# EAGLE design sit_up V2 (EAGLE 7.3.0)
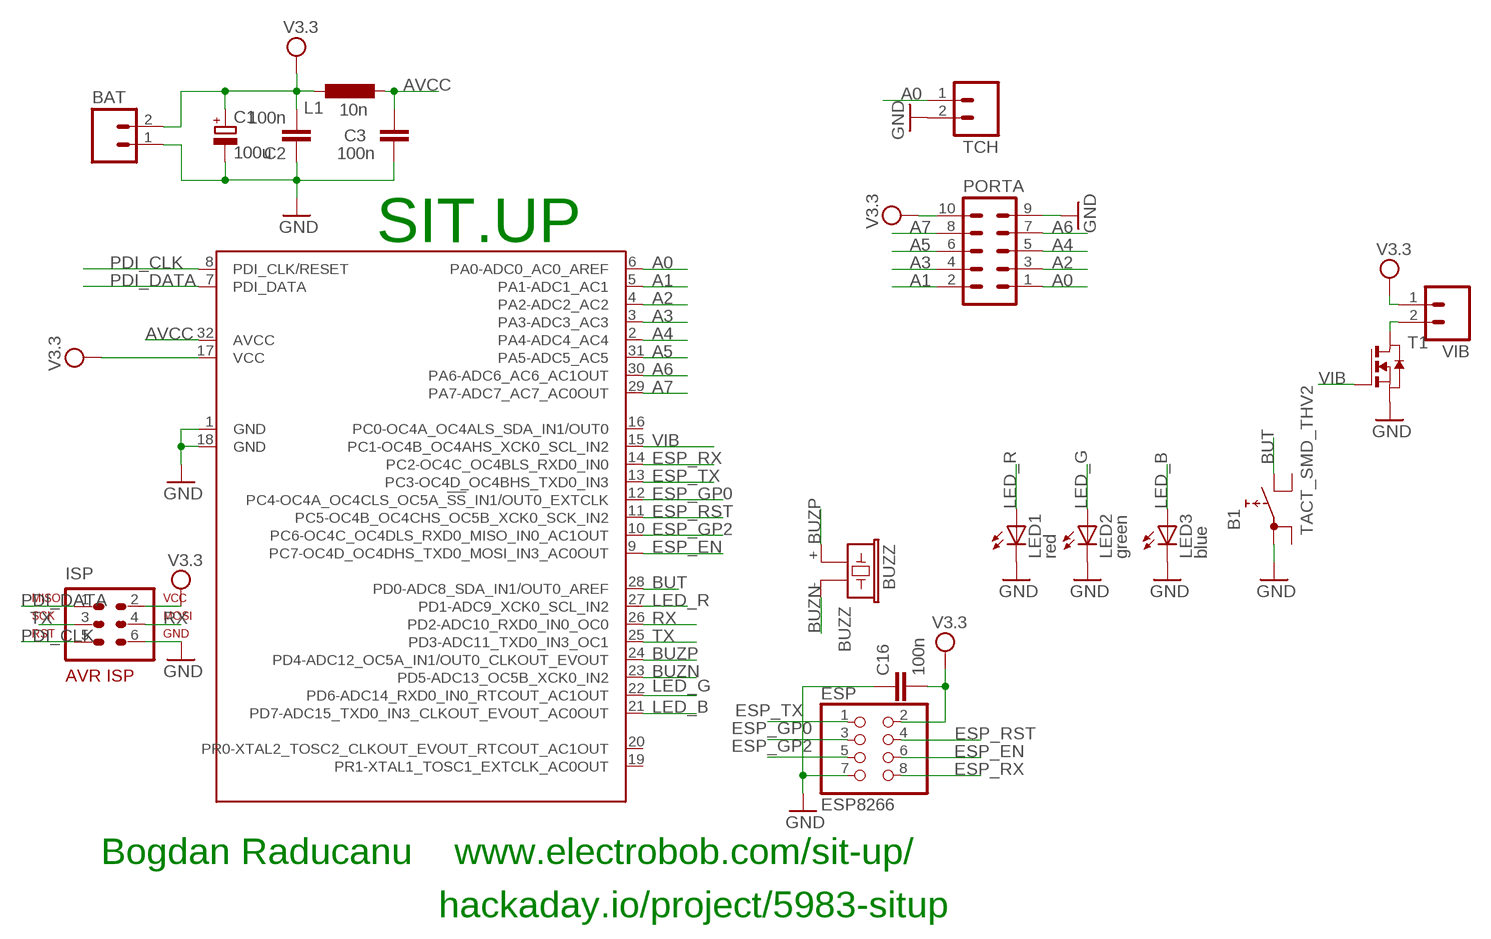
[diagram p0: schematic, sheet 1]

## Parts
B1  TACT_SMD_THV2  [TACT_6MM_SMD_2]
BAT  M02  [02P]
BUZZ  BUZZ  F/CM12P  [F/CM12P]
C1  100u  CPOL-EU153CLV-0505  [153CLV-0505]
C2  100n  C-EUC0805  [C0805]
C3  100n  C-EUC0805  [C0805]
C16  100n  C-EUC0805  [C0805]
ESP  ESP8266  PINHD-2X4  [2X04]
ISP  AVR-ISP-6VERT  [AVR-ISP-6]
L1  10n  L-EUL2012C  [L2012C]
LED1  red  LED3MM  [LED3MM]
LED2  green  LED3MM  [LED3MM]
LED3  blue  LED3MM  [LED3MM]
PORTA  MA05-2_PORT  [MA05_PORT]
T1  NMOSSOT23  [SOT-23]
TCH  M02  [02P]
VIB  M02  [02P]
XMEGA  XMEGA  E5-TQFP  [TQFP32]

## Nets
A0: PORTA.1 TCH.1 XMEGA.6(PA0-ADC0_AC0_AREF)
A1: PORTA.2 XMEGA.5(PA1-ADC1_AC1)
A2: PORTA.3 XMEGA.4(PA2-ADC2_AC2)
A3: PORTA.4 XMEGA.3(PA3-ADC3_AC3)
A4: PORTA.5 XMEGA.2(PA4-ADC4_AC4)
A5: PORTA.6 XMEGA.31(PA5-ADC5_AC5)
A6: PORTA.7 XMEGA.30(PA6-ADC6_AC6_AC1OUT)
A7: PORTA.8 XMEGA.29(PA7-ADC7_AC7_AC0OUT)
AVCC: C3.2 L1.2 XMEGA.32(AVCC)
BUT: B1.P$2(2A) XMEGA.28(PD0-ADC8_SDA_IN1/OUT0_AREF)
BUZN: BUZZ.- XMEGA.23(PD5-ADC13_OC5B_XCK0_IN2)
BUZP: BUZZ.+ XMEGA.24(PD4-ADC12_OC5A_IN1/OUT0_CLKOUT_EVOUT)
ESP_EN: ESP.6 XMEGA.9(PC7-OC4D_OC4DHS_TXD0_MOSI_IN3_AC0OUT)
ESP_GP0: ESP.3 XMEGA.12(PC4-OC4A_OC4CLS_OC5A_!SS!_IN1/OUT0_EXTCLK)
ESP_GP2: ESP.5 XMEGA.10(PC6-OC4C_OC4DLS_RXD0_MISO_IN0_AC1OUT)
ESP_RST: ESP.4 XMEGA.11(PC5-OC4B_OC4CHS_OC5B_XCK0_SCK_IN2)
ESP_RX: ESP.8 XMEGA.14(PC2-OC4C_OC4BLS_RXD0_IN0)
ESP_TX: ESP.1 XMEGA.13(PC3-OC4D_OC4BHS_TXD0_IN3)
GND: B1.P$1(1A) BAT.1 C1.- C2.1 C3.1 C16.1 ESP.7 ISP.6 LED1.K(C) LED2.K(C) LED3.K(C) PORTA.9 T1.2(S) TCH.2 XMEGA.1(GND) XMEGA.18(GND)
LED_B: LED3.A XMEGA.21(PD7-ADC15_TXD0_IN3_CLKOUT_EVOUT_AC0OUT)
LED_G: LED2.A XMEGA.22(PD6-ADC14_RXD0_IN0_RTCOUT_AC1OUT)
LED_R: LED1.A XMEGA.27(PD1-ADC9_XCK0_SCL_IN2)
N$4: T1.1(D) VIB.2
PDI_CLK: ISP.5 XMEGA.8(PDI_CLK/RESET)
PDI_DATA: ISP.1 XMEGA.7(PDI_DATA)
RX: ISP.4 XMEGA.26(PD2-ADC10_RXD0_IN0_OC0)
TX: ISP.3 XMEGA.25(PD3-ADC11_TXD0_IN3_OC1)
V3.3: BAT.2 C1.+ C2.2 C16.2 ESP.2 ISP.2 L1.1 PORTA.10 VIB.1 XMEGA.17(VCC)
VIB: T1.3(G) XMEGA.15(PC1-OC4B_OC4AHS_XCK0_SCL_IN2)
Unconnected: B1.P$3(1B) B1.P$4(2B) XMEGA.16(PC0-OC4A_OC4ALS_SDA_IN1/OUT0) XMEGA.19(PR1-XTAL1_TOSC1_EXTCLK_AC0OUT) XMEGA.20(PR0-XTAL2_TOSC2_CLKOUT_EVOUT_RTCOUT_AC1OUT)

## Notes on the sheet
- SIT.UP
- Bogdan Raducanu    www.electrobob.com/sit-up/
- hackaday.io/project/5983-situp

## Library data of the parts
B1 = tact:TACT_SMD_TH
BAT TCH VIB = con-amp-quick:M02: AMP QUICK CONNECTOR; OC_FARNELL: unknown; OC_NEWARK: unknown
BUZZ = buzzer:F/CM12P: BUZZER Source: Buerklin; OC_FARNELL: unknown; OC_NEWARK: unknown
C1 = rcl:CPOL-EU: POLARIZED CAPACITOR, European symbol
C2 C3 C16 = rcl:C-EU: CAPACITOR, European symbol
ESP = pinhead:PINHD-2X4: PIN HEADER
ISP = avr-7:AVR-ISP-6: AVR ISP-6 Serial Programming Header
L1 = resistor:L-EU: INDUCTOR, European symbol
LED1-LED3 = led:LED: LED OSRAM: - CHIPLED LG R971, LG N971, LY N971, LG Q971, LY Q971, LO R971, LY R971 LH N974, LH R974 LS Q976, LO Q976, LY Q976 LO Q996 - Hyper CHIPLED LW Q18S LB Q993, LB Q99A, LB R99A - SideLED LS A670, LO A670, LY A670, LG A670, LP A670 LB A673, LV A673, LT A673, LW A673 LH A674 LY A675 LS A676, LA A676, LO A676, LY A676, LW A676 LS A679, LY A679, LG A679 - Hyper Micro SIDELED® LS Y876, LA Y876, LO Y876, LY Y876 LT Y87S - SmartLED LW L88C, LW L88S LB L89C, LB L89S, LG L890 LS L89K, LO L89K, LY L89K LS L896, LA L896, LO L896, LY L896 - TOPLED LS T670, LO T670, LY T670, LG T670, LP T670 LSG T670, LSP T670, LSY T670, LOP T670, LYG T670 LG T671, LOG T671, LSG T671 LB T673, LV T673, LT T673, LW T673 LH T674 LS T676, LA T676, LO T676, LY T676, LB T676, LH T676, LSB T676, LW T676 LB T67C, LV T67C, LT T67C, LS T67K, LO T67K, LY T67K, LW E67C LS E67B, LA E67B, LO E67B, LY E67B, LB E67C, LV E67C, LT E67C LW T67C LS T679, LY T679, LG T679 LS T770, LO T770, LY T770, LG T770, LP T770 LB T773, LV T773, LT T773, LW T773 LH T774 LS E675, LA E675, LY E675, LS T675 LS T776, LA T776, LO T776, LY T776, LB T776 LHGB T686 LT T68C, LB T68C - Hyper Mini TOPLED® LB M676 - Mini TOPLED Santana® LG M470 LS M47K, LO M47K, LY M47K Source: http://www.osram.convergy.de LUXEON: - LUMILED® LXK2-PW12-R00, LXK2-PW12-S00, LXK2-PW14-U00, LXK2-PW14-V00 LXK2-PM12-R00, LXK2-PM12-S00, LXK2-PM14-U00 LXK2-PE12-Q00, LXK2-PE12-R00, LXK2-PE12-S00, LXK2-PE14-T00, LXK2-PE14-U00 LXK2-PB12-K00, LXK2-PB12-L00, LXK2-PB12-M00, LXK2-PB14-N00, LXK2-PB14-P00, LXK2-PB14-Q00 LXK2-PR12-L00, LXK2-PR12-M00, LXK2-PR14-Q00, LXK2-PR14-R00 LXK2-PD12-Q00, LXK2-PD12-R00, LXK2-PD12-S00 LXK2-PH12-R00, LXK2-PH12-S00 LXK2-PL12-P00, LXK2-PL12-Q00, LXK2-PL12-R00 Source: www.luxeon.com KINGBRIGHT: KA-3528ASYC Source: www.kingbright.com
PORTA = con-lstb:MA05-2: PIN HEADER
T1 = zetex:NMOSSOT23: MOS FET; OC_FARNELL: unknown; OC_NEWARK: unknown
XMEGA = Xmegae5:E5

## Net classes
1 power: width 0.381 mm, clearance 0.254 mm

## Board
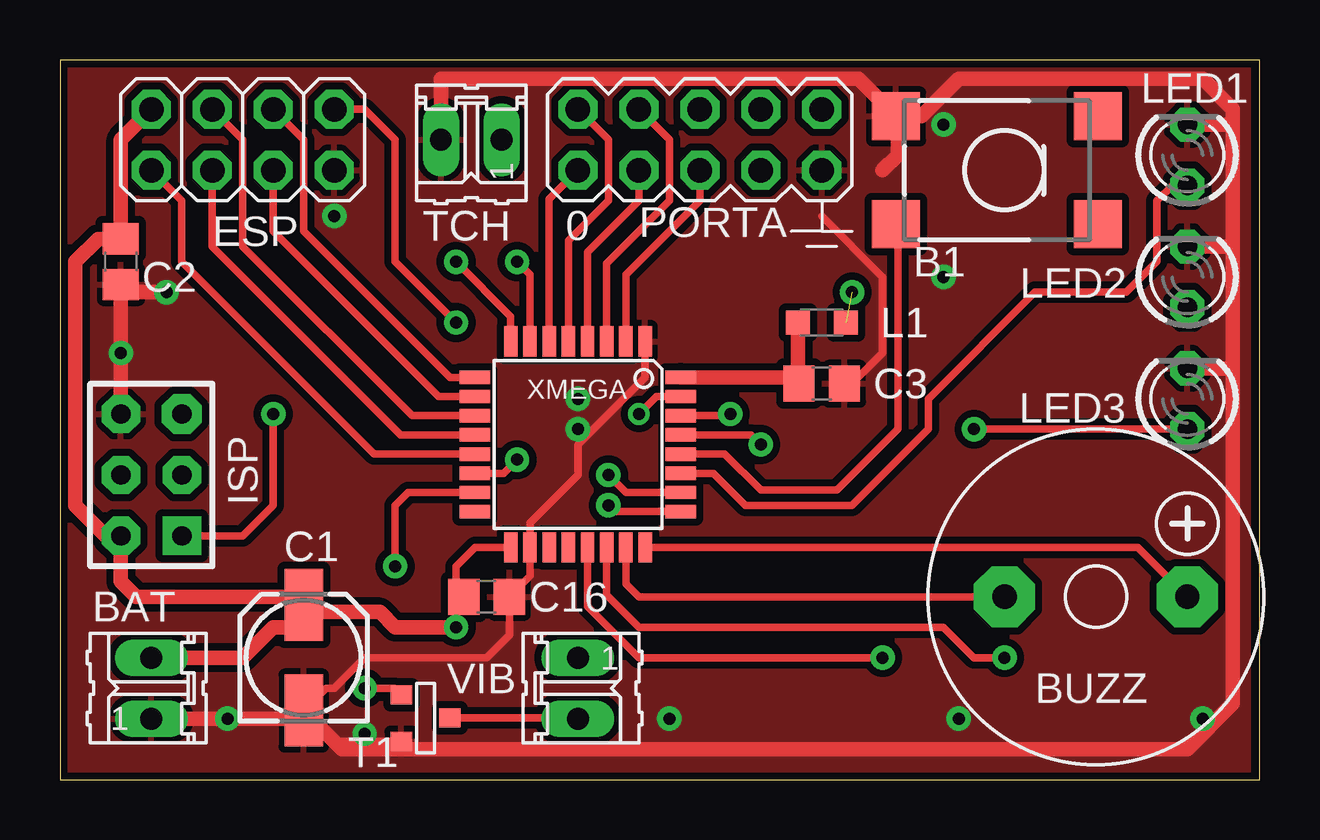
[diagram p1: board, top side]
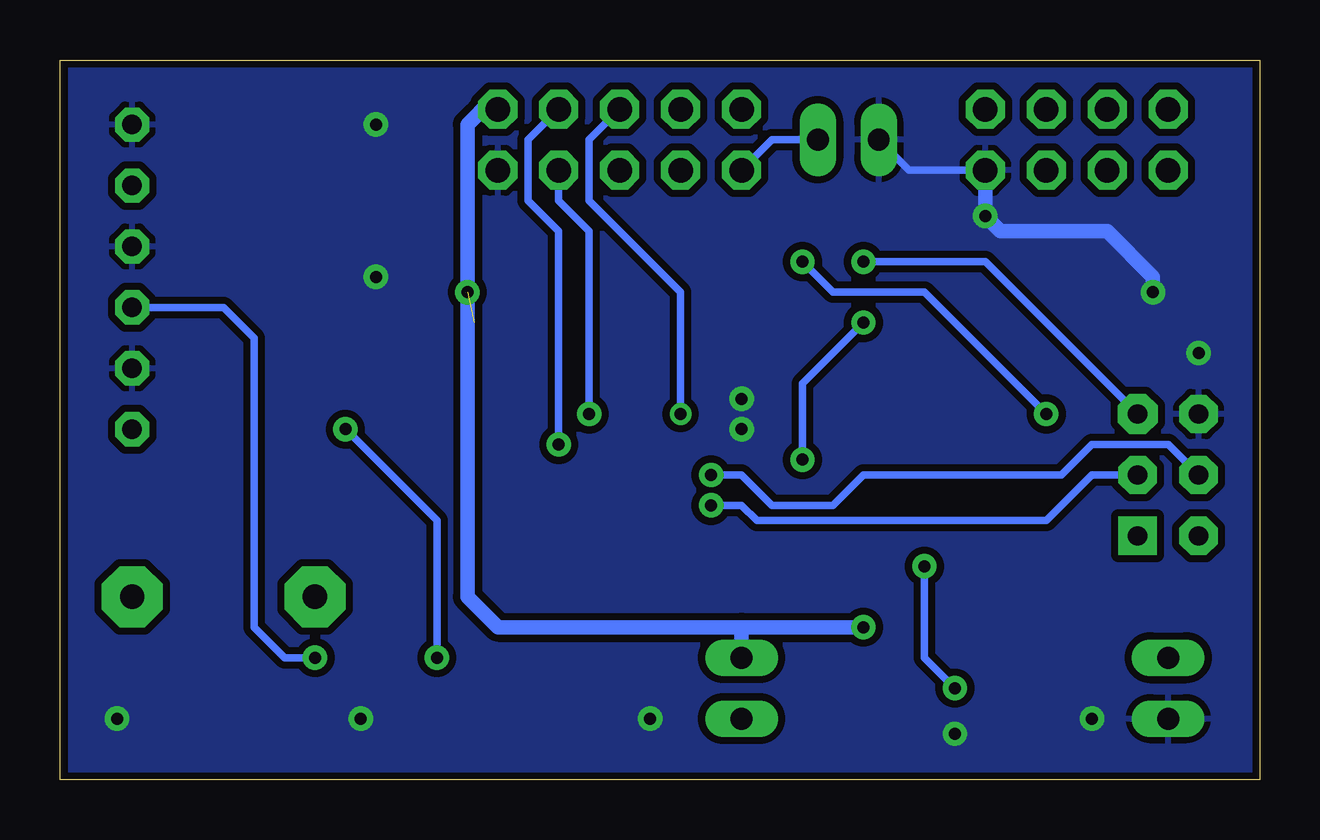
[diagram p2: board, bottom side, seen from below]

Size 50 x 30 mm. Coordinates in mm from the lower left corner, seen from the top.
Outline: 0,0 50,0 50,30 0,30 0,0
Copper layers (1*16): Top 0.035mm / dielectric 1.5mm / Bottom 0.035mm
Design rules "DFRobot_Eagle_Rule_v0.4": minimum track width 6mil, minimum drill 12mil, track to track 6mil, track to pad 6mil, pad to pad 6mil, via to via 6mil, smd to smd 0mil, copper to edge 10mil, drill to drill 10mil, minimum pad ring 12mil, minimum via ring 8mil, stop-mask expansion 2mil, vias tented up to drill 25mil, thermal gap 10mil

### Footprints (pad centres in the part's own frame; a part is rotated, then mirrored left to right if it is on the bottom)
TACT_6MM_SMD_2 = smd 2 x 2: P$1 -2.25,-4.52; P$2 2.25,-4.52; P$3 2.25,3.885; P$4 -2.25,3.885
02P = drill 0.914 long: 1 -1.27,0; 2 1.27,0
F/CM12P = drill 1.016 pad 2.54 octagon: + 3.81,0; - -3.81,0
153CLV-0505 = smd 3 x 1.6: + 2.2,0; - -2.2,0
C0805 = smd 1.3 x 1.5: 1 -0.95,0; 2 0.95,0
2X04 = drill 1.016 octagon: 1 -3.81,-1.27; 2 -3.81,1.27; 3 -1.27,-1.27; 4 -1.27,1.27; 5 1.27,-1.27; 6 1.27,1.27; 7 3.81,-1.27; 8 3.81,1.27
AVR-ISP-6 = drill 0.8 pad 1.6 square: 1 -2.54,-1.27 | drill 0.8 pad 1.6 octagon: 2 -2.54,1.27; 3 0,-1.27; 4 0,1.27; 6 2.54,1.27 | drill 0.8 pad 1.67 octagon: 5 2.54,-1.27
L2012C = smd 1 x 1: 1 -1,0; 2 1,0
LED3MM = drill 0.813 octagon: A -1.27,0; K 1.27,0
MA05_PORT = drill 1.016 octagon: 1 -5.08,-1.27; 2 -5.08,1.27; 3 -2.54,-1.27; 4 -2.54,1.27; 5 0,-1.27; 6 0,1.27; 7 2.54,-1.27; 8 2.54,1.27; 9 5.08,-1.27; 10 5.08,1.27
SOT-23 = smd 0.787 x 0.889: 1 0.025,-1.016; 2 -0.94,1.016; 3 0.991,1.016
TQFP32 = smd 1.27 x 0.559: 1 -4.293,2.8; 2 -4.293,2; 3 -4.293,1.2; 4 -4.293,0.4; 5 -4.293,-0.4; 6 -4.293,-1.2; 7 -4.293,-2; 8 -4.293,-2.8; 17 4.293,-2.8; 18 4.293,-2; 19 4.293,-1.2; 20 4.293,-0.4; 21 4.293,0.4; 22 4.293,1.2; 23 4.293,2; 24 4.293,2.8 | smd 0.559 x 1.27: 9 -2.8,-4.293; 10 -2,-4.293; 11 -1.2,-4.293; 12 -0.4,-4.293; 13 0.4,-4.293; 14 1.2,-4.293; 15 2,-4.293; 16 2.8,-4.293; 25 2.8,4.293; 26 2,4.293; 27 1.2,4.293; 28 0.4,4.293; 29 -0.4,4.293; 30 -1.2,4.293; 31 -2,4.293; 32 -2.8,4.293

### Placement (x,y rotation side)
B1  39.37,25.4 270 top
BAT  3.81,3.81 90 top
BUZZ  43.18,7.62 0 top
C1  10.16,5.08 90 top
C2  2.54,21.59 90 top
C3  31.75,16.51 180 top
C16  17.78,7.62 180 top
ESP  7.62,26.67 0 top
ISP  3.81,12.7 90 top
L1  31.75,19.05 180 top
LED1  46.99,26.04 90 top
LED2  46.99,20.95 90 top
LED3  46.99,15.88 90 top
PORTA  26.67,26.67 0 top
T1  15.24,2.54 90 top
TCH  17.14,26.67 180 top
VIB  21.59,3.81 270 top
XMEGA  21.59,13.97 270 top

### Tracks (layer width: path | path; a pad name or v marks a point on that pad's centre or on a via)
A0
  Top 0.305: XMEGA.6 20.39,24.2 PORTA.1
  Bottom 0.305: TCH.1 20.32,26.67 PORTA.1
A1
  Top 0.305: XMEGA.5 21.19,22.46 22.86,24.13 22.86,26.67 PORTA.2
A2
  Top 0.305: XMEGA.4 21.99,21.99 24.13,24.13 PORTA.3
A3
  Top 0.305: XMEGA.3 22.79,21.52 25.4,24.13 25.4,26.67 PORTA.4
A4
  Top 0.305: XMEGA.2 23.59,21.05 26.67,24.13 PORTA.5
A5  (via drill 0.5)
  Top 0.305: XMEGA.31 24.86,15.97 v24.13,15.24
  Bottom 0.305: v24.13,15.24 24.13,20.32 27.94,24.13 27.94,26.67 PORTA.6
A6  (via drill 0.5 pad 1.02)
  Top 0.305: XMEGA.30 27.87,15.17 v27.94,15.24
  Bottom 0.305: v27.94,15.24 27.94,22.86 29.21,24.13 PORTA.7
A7  (via drill 0.5 pad 1.02)
  Top 0.305: XMEGA.29 28.81,14.37 v29.21,13.97
  Bottom 0.305: v29.21,13.97 29.21,22.86 30.48,24.13 30.48,26.67 PORTA.8
AVCC
  Top 0.61: XMEGA.32 30.54,16.77 C3.2 30.75,16.56 L1.2
BUT
  Top 0.305: XMEGA.28 27.7,13.57 29.21,12.06 32.38,12.06 34.92,14.61 34.92,23.23 B1.P$2
BUZN
  Top 0.305: XMEGA.23 23.59,8.16 24.13,7.62 BUZZ.-
BUZP
  Top 0.305: XMEGA.24 44.93,9.68 BUZZ.+
ESP_EN
  Top 0.305: ESP.6 10.16,26.67 10.16,22.86 16.25,16.77 XMEGA.9
ESP_GP0
  Top 0.305: ESP.3 6.35,22.23 14.21,14.37 XMEGA.12
ESP_GP2
  Top 0.305: ESP.5 8.89,22.86 15.78,15.97 XMEGA.10
ESP_RST
  Top 0.305: ESP.4 7.62,26.67 7.62,22.23 14.68,15.17 XMEGA.11
ESP_RX  (via drill 0.5 pad 1.02)
  Top 0.305: ESP.8 12.7,27.94 13.97,26.67 13.97,21.59 v16.51,19.05 | XMEGA.14 18.48,12.77 v19.05,13.34
  Bottom 0.305: v16.51,19.05 19.05,16.51 v19.05,13.34
ESP_TX
  Top 0.305: XMEGA.13 13.1,13.57 5.08,21.59 5.08,24.13 ESP.1
GND  (via drill 0.5 pad 1.02)
  Top 0.305: XMEGA.1 24.39,16.77 21.59,13.97 21.59,12.7 19.59,10.7 XMEGA.18 19.59,8.48 C16.1 18.73,6.03 17.78,5.08 12.7,5.08 11.43,3.81 11.09,3.81 C1.- 11.44,1.6 T1.2 | C3.1 33.02,16.51 34.29,17.78 34.29,20.95 31.75,23.5
  Top 0.61: B1.P$1 35.91,27.65 37.47,29.21 47.62,29.21 48.9,27.94 48.9,27.3 | 34.29,25.4 34.92,26.04 34.92,27.57 B1.P$1 | TCH.2 15.88,29.21 33.29,29.21 B1.P$1 | v4.45,20.32 2.86,20.32 C2.1 ISP.6 | BAT.1 9.82,2.54 C1.- 11.77,1.27 46.99,1.27 48.9,3.17 48.9,17.14 | 48.9,17.14 48.9,22.23 | 48.9,22.23 48.9,27.3 | LED1.K 48.9,27.3 | LED2.K 48.9,22.23 | LED3.K 48.9,17.14
  Bottom 0.305: ESP.7 14.61,25.4 TCH.2
  Bottom 0.61: ESP.7 v11.43,23.5 10.79,22.86 6.35,22.86 4.45,20.95 v4.45,20.32
  other vias: 2.54,17.78 6.99,2.54 12.7,1.91 21.59,15.88 21.59,14.61 47.62,2.54 37.47,2.54 25.4,2.54 36.83,20.95 36.83,27.3
  pour Top (isolate 0.3): 0,0 49.53,0 49.53,29.84 0,29.84
  pour Bottom (isolate 0.3): 0,0 49.53,0 49.53,29.84 0,29.84
LED_B  (via drill 0.5 pad 1.02)
  Top 0.305: XMEGA.21 21.99,7.22 24.13,5.08 v34.29,5.08 | v38.1,14.61 LED3.A
  Bottom 0.305: v34.29,5.08 34.29,10.79 v38.1,14.61
LED_G  (via drill 0.5 pad 1.02)
  Top 0.305: XMEGA.22 22.79,7.69 24.13,6.35 36.83,6.35 38.1,5.08 v39.37,5.08
  Bottom 0.305: v39.37,5.08 40.64,5.08 41.91,6.35 41.91,18.41 43.18,19.68 LED2.A
LED_R
  Top 0.305: XMEGA.27 27.23,12.77 28.57,11.43 33.02,11.43 36.2,14.61 36.2,15.88 40.64,20.32 44.45,20.32 45.72,21.59 45.72,24.13 46.35,24.77 LED1.A
N$4
  Top 0.305: T1.1 21.57,2.56 VIB.2
PDI_CLK  (via drill 0.5 pad 1.02)
  Top 0.305: XMEGA.8 18.79,19.31 v16.51,21.59
  Bottom 0.305: v16.51,21.59 11.43,21.59 ISP.5
PDI_DATA  (via drill 0.5 pad 1.02)
  Top 0.305: ISP.1 7.62,10.16 8.89,11.43 v8.89,15.24 | XMEGA.7 19.59,21.05 v19.05,21.59
  Bottom 0.305: v8.89,15.24 13.97,20.32 17.78,20.32 v19.05,21.59
RX  (via drill 0.5 pad 1.02)
  Top 0.305: XMEGA.26 23.59,11.97 v22.86,12.7
  Bottom 0.305: v22.86,12.7 21.59,12.7 20.32,11.43 17.78,11.43 16.51,12.7 8.26,12.7 6.99,13.97 3.81,13.97 ISP.4
TX  (via drill 0.5 pad 1.02)
  Top 0.305: XMEGA.25 23.12,11.17 v22.86,11.43
  Bottom 0.305: v22.86,11.43 21.59,11.43 20.95,10.79 8.89,10.79 6.99,12.7 ISP.3
V3.3  (via drill 0.5 pad 1.02)  (1 unrouted)
  Top 0.305: C2.2 2.22,22.54 | 10.16,6.35 C1.+ 10.5,7.62 | XMEGA.17 17.3,9.68 16.51,8.89 16.51,7.94 C16.2 16.51,7.3 v16.51,6.35
  Top 0.61: v16.51,6.35 13.97,6.35 13.34,6.99 10.46,6.99 C1.+ 9.82,7.62 3.17,7.62 2.54,8.26 ISP.2 1.91,10.16 0.64,11.43 0.64,21.59 1.58,22.54 2.22,22.54 | 10.16,6.35 8.89,6.35 7.62,5.08 BAT.2 | C2.2 2.54,26.67 ESP.2
  Bottom 0.61: 21.59,6.35 31.75,6.35 33.02,7.62 v33.02,20.32 33.02,27.3 32.7,27.62 32.38,27.94 PORTA.10 | 21.59,6.35 v16.51,6.35 | VIB.1 21.59,6.35
VIB  (via drill 0.5 pad 1.02)
  Top 0.305: XMEGA.15 14.51,11.97 13.97,11.43 v13.97,8.89 | v12.7,3.81 13.95,3.81 T1.3
  Bottom 0.305: v13.97,8.89 13.97,5.08 v12.7,3.81

### Text on the board
tDocu: + | Sit.Up!! / v2 | electrobob.com